# EasyEDA Pro project V2.1.1 AC Power Switch.epro

# Schematic V2.1.1 Schematic
Board Name: V2.1.1 AC Power Switch; Create Date: 2024-09-30; Page Name: Main Page; Project Name: Access Control AC Power Switch; Schematic Name: V2.1.1 Schematic; Update Date: 2025-06-26
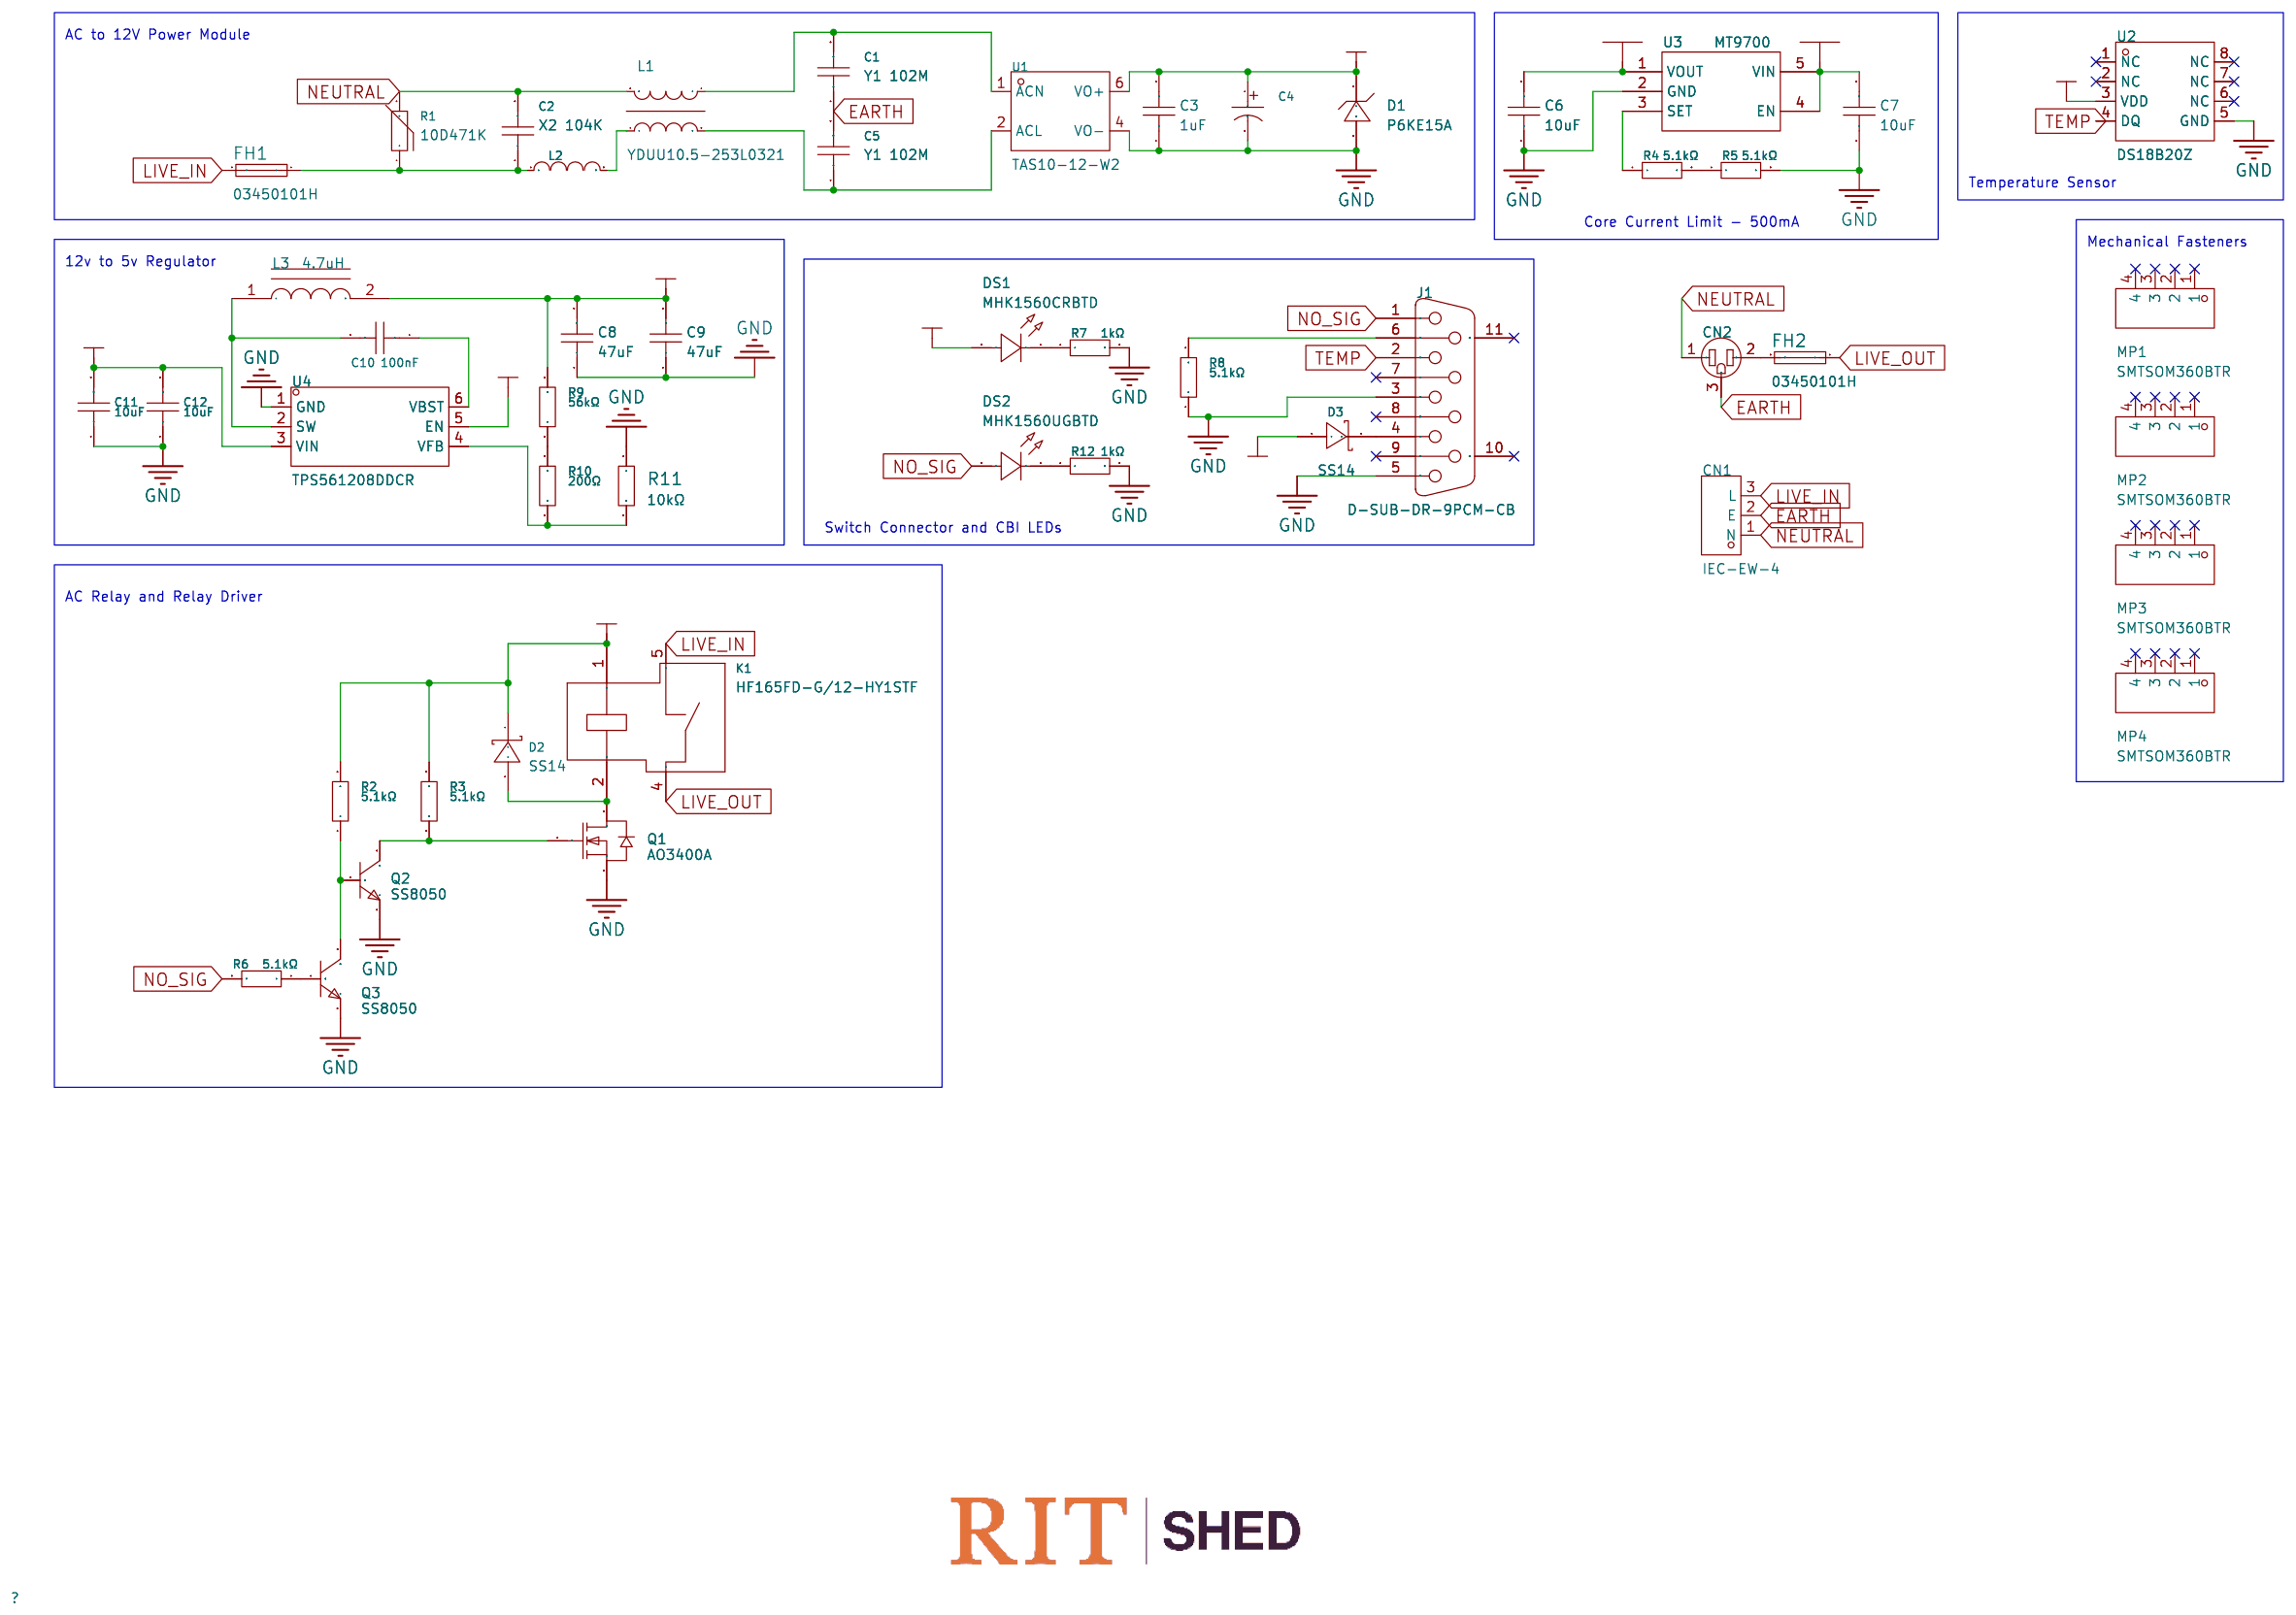
[diagram p0: schematic sheet]

## Parts
C1  1nF  [CAP-TH_L8.5-W5.0-P10.00-D0.6]
C2  100nF  [CAP-TH_L10.0-W5.0-P7.50-D0.6]
C3  1uF  [C1206]
C4  220uF  [CAP-TH_BD6.3-P2.50-D1.0-FD]
C5  1nF  [CAP-TH_L8.5-W5.0-P10.00-D0.6]
C6  10uF  [C0603]
C7  10uF  [C0603]
C8  47uF  [C1206]
C9  47uF  [C1206]
C10  100nF  [C0603]
C11  10uF  [C0603]
C12  10uF  [C0603]
CN1  IEC-EW-4  [CONN-TH_IEC-EW-4]
CN2  -  [739W-X2/32]
D1  P6KE15A  [DO-15_BD3.1-L6.7-P10.70-D0.9-RD]
D2  SS14  [SMA_L4.2-W2.6-LS5.3-RD]
D3  SS14  [SMA_L4.2-W2.6-LS5.3-RD]
DS1  MHK1560CRBTD  [LED-TH_MHK1560UGBTD]
DS2  MHK1560UGBTD  [LED-TH_MHK1560UGBTD]
FH1  03450101H  [03450101H]
FH2  03450101H  [03450101H]
J1  D-SUB-DR-9PCM-CB  [DB9-TH_ID09S33E4GV00LF]
K1  HF165FD-G/12-HY1STF  [RELAY-TH_HF165FD-G-12-HY1STF]
L1  YDUU10.5-253L0321  [IND-TH_4P-L19.0-W17.0]
L2  560uH  [IND-TH_BD9.0-P5.00-D0.7]
L3  4.7uH  [IND-SMD_L4.4-W4.2]
MP1  SMTSOM360BTR  [SMD_BD5.6-D4.1]
MP2  SMTSOM360BTR  [SMD_BD5.6-D4.1]
MP3  SMTSOM360BTR  [SMD_BD5.6-D4.1]
MP4  SMTSOM360BTR  [SMD_BD5.6-D4.1]
Q1  AO3400A  [SOT-23-3_L2.9-W1.3-P1.90-LS2.4-BR]
Q2  SS8050  [SOT-23-3_L2.9-W1.3-P1.90-LS2.4-BR]
Q3  SS8050  [SOT-23-3_L2.9-W1.3-P1.90-LS2.4-BR]
R1  10D471K  [RES-TH_L12.5-W6.7-P7.50-D1.2]
R2  5.1kΩ  [R0603]
R3  5.1kΩ  [R0603]
R4  5.1kΩ  [R0603]
R5  5.1kΩ  [R0603]
R6  5.1kΩ  [R0603]
R7  1kΩ  [R0603]
R8  5.1kΩ  [R0603]
R9  56kΩ  [R0603]
R10  200Ω  [R0603]
R11  10kΩ  [R0603]
R12  1kΩ  [R0603]
U1  TAS10-12-W2  [PWRM-TH_TAS10-XX-W2]
U2  DS18B20Z  [SOP-8_L4.9-W3.9-P1.27-LS6.0-BL]
U3  MT9700  [SOT-23-5_L3.0-W1.7-P0.95-LS2.8-BR]
U4  TPS561208DDCR  [TSOT-23-6_L2.9-W1.6-P0.95-LS2.8-BR]

## Library data of the parts
C1 C5 = VY1102M31Y5UC63V0: Capacitance: Tolerance:±20% Tolerance:±20% Voltage(AC):760V Subclass: Operating Temperature:-40℃~+125℃ Operating Temperature:-40℃~+125℃; LCSC Part Name: 等级:X1,Y1 1nF ±20% 760V; Supplier Part: C1620957; Manufacturer: VISHAY(威世); Supplier Footprint: 插件,P=10mm; JLCPCB Part Class: Extended Part; Datasheet: https://atta.szlcsc.com/upload/public/pdf/source/20210503/4C6D9DFEC0766624DBEA7F26F929BB18.pdf; Supplier: LCSC; Tolerance: ±20%; Voltage(AC): 760V; Operating Temperature: -40℃~+125℃
C2 = PX104K2C0702: Capacitance: Tolerance:±10% Tolerance:±10% Voltage(AC):310V；380V；350V Subclass: Operating Temperature:-40℃~+110℃ Operating Temperature:-40℃~+110℃; LCSC Part Name: 等级:X2 100nF ±10% 310V 350V 380V; Supplier Part: C2693793; Manufacturer: KYET(科雅); Supplier Footprint: 插件,P=7.5mm; JLCPCB Part Class: Extended Part; Datasheet: https://atta.szlcsc.com/upload/public/pdf/source/20230824/212A883DA7F3524E26A294E17BC5A0F4.pdf; Supplier: LCSC; Tolerance: ±10%; Voltage(AC): 310V；380V；350V; Operating Temperature: -40℃~+110℃
C3 = CL31B105KBHNNNE: Capacitance: Tolerance:±10% Tolerance:±10% Voltage Rated: Temperature Coefficient:; LCSC Part Name: 1uF ±10% 50V; Supplier Part: C1848; Manufacturer: SAMSUNG(三星); Supplier Footprint: 1206; JLCPCB Part Class: Basic Part; Datasheet: https://atta.szlcsc.com/upload/public/pdf/source/20160218/1457707763339.pdf; Supplier: LCSC; Tolerance: ±10%
C4 = KM227M025E11RR0VH2FP0: Capacitance:220uF Tolerance:±20% Tolerance:±20% Rated Voltage: Ripple Current:- Equivalent Series Resistance(ESR):- Lead Spacing: φD: L: Lifetime @ Temp:1000hrs@105℃; LCSC Part Name: 220uF ±20% 25V; Supplier Part: C12450; Manufacturer: CX(承兴); Supplier Footprint: 插件,D6.3xL11mm; JLCPCB Part Class: Extended Part; Datasheet: https://atta.szlcsc.com/upload/public/pdf/source/20211027/06D6BA3719C264B639DC286D935D03EA.pdf; Supplier: LCSC; Tolerance: ±20%; Lifetime @ Temp: 1000hrs@105℃
C6 C7 = CL10A106MA8NRNC: Capacitance: Tolerance:±20% Tolerance:±20% Voltage Rated: Temperature Coefficient:; LCSC Part Name: 10uF ±20% 25V; Supplier Part: C96446; Manufacturer: SAMSUNG(三星); Supplier Footprint: 0603; Datasheet: https://atta.szlcsc.com/upload/public/pdf/source/20170325/1490427913016.pdf; Supplier: LCSC; Tolerance: ±20%
C8 C9 = CL31A476MPHNNNE: Capacitance: Tolerance:±20% Tolerance:±20% Voltage Rated: Temperature Coefficient:; LCSC Part Name: 47uF ±20% 10V; Supplier Part: C96123; Manufacturer: SAMSUNG(三星); Supplier Footprint: 1206; JLCPCB Part Class: Basic Part; Datasheet: https://atta.szlcsc.com/upload/public/pdf/source/20160218/1457707763339.pdf; Supplier: LCSC; Tolerance: ±20%
C10 = CC0603KRX7R9BB104: Capacitance: Tolerance:±10% Tolerance:±10% Voltage Rated: Temperature Coefficient:; LCSC Part Name: 100nF ±10% 50V; Supplier Part: C14663; Manufacturer: YAGEO(国巨); Supplier Footprint: 0603; JLCPCB Part Class: Basic Part; Datasheet: https://atta.szlcsc.com/upload/public/pdf/source/20180910/C282072_33301C7F631E79921B82A8DAC6BCC5B3.pdf; Supplier: LCSC; Tolerance: ±10%
C11 C12 = CL10A106MA8NRNC: Capacitance: Tolerance:±20% Tolerance:±20% Voltage Rated: Temperature Coefficient:; LCSC Part Name: 10uF ±20% 25V; Supplier Part: C96446; Manufacturer: SAMSUNG(三星); Supplier Footprint: 0603; JLCPCB Part Class: Basic Part; Datasheet: https://atta.szlcsc.com/upload/public/pdf/source/20160218/1457707763339.pdf; Supplier: LCSC; Tolerance: ±20%
CN1 = IEC-EW-4: Supplier Part: C17684530; Manufacturer: ADAM TECH; JLCPCB Part Class: Extended Part; Supplier: LCSC
CN2 = 739W-X2/32
D1 = P6KE15A_C432720: Reverse Stand-Off Voltage (Vrwm):12.8V Maximum Clamping Voltage:21.2V Peak Pulse Current (Ipp)@10/1000us:29A Breakdown Voltage:14.3V Type:TVS; LCSC Part Name: TVS 12.8V截止 28A峰值脉冲; Supplier Part: C432720; Manufacturer: PINGWEI(平伟); Supplier Footprint: DO-15; JLCPCB Part Class: Extended Part; Datasheet: https://atta.szlcsc.com/upload/public/pdf/source/20191125/C432720_41B798BD7A6A58F5BCFD447C95CDC42D.pdf; Supplier: LCSC; Reverse Stand-Off Voltage (Vrwm): 12.8V; Maximum Clamping Voltage: 21.2V; Peak Pulse Current (Ipp)@10/1000us: 29A; Breakdown Voltage: 14.3V; Type: TVS
D2 D3 = SS14_C2480: Diode Configuration:Single Forward Voltage (Vf@If):550mV@1A Reverse Voltage (Vr):40V Average Rectified Current (Io):1A Reverse Leakage Current (Ir):500uA@40V; LCSC Part Name: 电压:40V 电流:1A; Supplier Part: C2480; Manufacturer: MDD; Supplier Footprint: SMA(DO-214AC); JLCPCB Part Class: Basic Part; Datasheet: https://atta.szlcsc.com/upload/public/pdf/source/20230712/2DB6064CFBB99DE6DB116BEE8208BE66.pdf; Supplier: LCSC; Diode Configuration: Single; Forward Voltage (Vf@If): 550mV@1A; Reverse Voltage (Vr): 40V; Average Rectified Current (Io): 1A; Reverse Leakage Current (Ir): 500uA@40V
DS1 = MHK1560CGBTD: 20mA 雾状红透镜 50mcd -40℃~+85℃ 632nm Red 85° 1.75V~2.2V Plugin,P=2.54mm Light Emitting Diodes (LED) ROHS; LCSC Part Name: 1560直插单灯翠绿色光; Supplier Part: C7470835; Manufacturer: MEIHUA(美华); Supplier Footprint: 插件,P=2.54mm; JLCPCB Part Class: Extended Part; Datasheet: https://atta.szlcsc.com/upload/public/pdf/source/20231114/0151DB1F997DCF286213A722D08B4BAA.pdf; Supplier: LCSC; Emitted Color: Emerald; Forward Voltage (VF): 1.75V~2.2V; Forward Current: 20mA; Dominant Wavelength: 520nm; Lens Color: 雾状绿透镜; Luminous Intensity: 1000mcd; Viewing Angle: 85°; Operating Temperature: -40℃~+85℃
DS2 = MHK1560UGBTD: Emitted Color:Emerald Forward Voltage (VF):1.75V~2.2V Forward Voltage (VF):1.75V~2.2V Forward Current:20mA Dominant Wavelength:520nm Dominant Wavelength:520nm Lens Color:雾状绿透镜 Luminous Intensity:1000mcd Luminous Intensity:1000mcd Viewing Angle:85° Operati; LCSC Part Name: 1560直插单灯翠绿色光; Supplier Part: C7470833; Manufacturer: MEIHUA(美华); Supplier Footprint: 插件,P=2.54mm; JLCPCB Part Class: Extended Part; Datasheet: https://atta.szlcsc.com/upload/public/pdf/source/20231114/0151DB1F997DCF286213A722D08B4BAA.pdf; Supplier: LCSC; Emitted Color: Emerald; Forward Voltage (VF): 1.75V~2.2V; Forward Current: 20mA; Dominant Wavelength: 520nm; Lens Color: 雾状绿透镜; Luminous Intensity: 1000mcd; Viewing Angle: 85°; Operating Temperature: -40℃~+85℃
FH1 FH2 = 03450101H: Fuseholder Type:- Fuse Type:- Fuse Size:-; Supplier Part: C206934; Manufacturer: Littelfuse(美国力特); JLCPCB Part Class: Extended Part; Datasheet: https://atta.szlcsc.com/upload/public/pdf/source/20180717/C206934_D0DC376832E6152EDA155E6DDF74EAF3.pdf; Supplier: LCSC
J1 = D-SUB-DR-9PCM-CB: Connector Type:D-Sub Gender:Female Number of Pins:9P Mounting Style:Right-Angle Number of Rows:2 Current Rating (Max):3A Contact Plating:Tin Operating Temperature Range:-50℃~+105℃ Operating Temperature Range:-50℃~+105℃; LCSC Part Name: D-Sub 母 P数:9P; Supplier Part: C19077337; Manufacturer: XUNPU(讯普); Supplier Footprint: 弯插; JLCPCB Part Class: Extended Part; Datasheet: https://atta.szlcsc.com/upload/public/pdf/source/20231108/FB2E8AB0BE4F620DDF3F7F4D0B9AFB97.pdf; Supplier: LCSC; Connector Type: D-Sub; Gender: Female; Number of Pins: 9P; Mounting Style: Right-Angle; Number of Rows: 2; Current Rating (Max): 3A; Contact Plating: Tin; Operating Temperature Range: -50℃~+105℃
K1 = HF165FD-G/12-HY1STF: Coil Voltage:12V Contact Form:一组常开:1A(SPST-常开) Pin Number:4 Contact Rating:40A@277VAC Maximum Switching Voltage:277V@AC Coil Rated Power:900mW Contact Material:AgSnO2 Maximum Switching Current:40A Coil Type:无极性-单线圈 Coil Resistance:155Ω Contact Resistance:; Supplier Part: C129738; Manufacturer: HF(宏发); Supplier Footprint: 插件,27.5x32.2mm; JLCPCB Part Class: Extended Part; Datasheet: https://atta.szlcsc.com/upload/public/pdf/source/20171116/C139499_15108221312811123741.pdf; Supplier: LCSC; Coil Voltage: 12V; Contact Form: 一组常开:1A(SPST-常开); Pin Number: 4; Contact Rating: 40A@277VAC; Maximum Switching Voltage: 277V@AC; Coil Rated Power: 900mW; Contact Material: AgSnO2; Maximum Switching Current: 40A; Coil Type: 无极性-单线圈; Coil Resistance: 155Ω; Contact Resistance: 100mΩ; Operate Time: 15ms; Release Time: 10ms; Operating Temperature: -40℃~+85℃
L1 = YDUU10.5-253L0321: Number of Lines:2 Withstanding Voltage:1.5kV@AC Inductance @ Frequency:25mH@1KHz; LCSC Part Name: UU10.5 25mH @1KHz; Supplier Part: C5200263; Manufacturer: YJYCOIN(益嘉源); Supplier Footprint: 插件,19x17x22mm; JLCPCB Part Class: Extended Part; Datasheet: https://atta.szlcsc.com/upload/public/pdf/source/20221019/CF3EF2D4E89C9F1A1EF6A77931981DBC.pdf; Supplier: LCSC; Number of Lines: 2; Withstanding Voltage: 1.5kV@AC; Inductance @ Frequency: 25mH@1KHz
L2 = PK0810-561KB: Inductance: Tolerance:±10% Tolerance:±10% Rated Current: DC Resistance (DCR): Type:工字电感; LCSC Part Name: 560uH ±10%; Supplier Part: C122800; Manufacturer: SXN(顺翔诺); Supplier Footprint: 插件; JLCPCB Part Class: Extended Part; Datasheet: https://atta.szlcsc.com/upload/public/pdf/source/20210810/BA6D1DA7D4BCBB7C641BC97B42CFC6FF.pdf; Supplier: LCSC; Tolerance: ±10%; Type: 工字电感
L3 = BCIHP0420SC-4R7M: Inductance: Tolerance:±20% Tolerance:±20% Rated Current: Saturation Current (Isat): DC Resistance (DCR):126mΩ Q @ Freq:- Frequency - Self Resonant:-; LCSC Part Name: 4.7uH ±20% 3A; Supplier Part: C2921168; Manufacturer: BC(台湾诚阳); Supplier Footprint: SMD,4.2x4.4mm; JLCPCB Part Class: Extended Part; Datasheet: https://atta.szlcsc.com/upload/public/pdf/source/20220607/0F62A2B68923DD0945D5F83B99590D06.pdf; Supplier: LCSC; Tolerance: ±20%; DC Resistance (DCR): 126mΩ
MP1-MP4 = SMTSOM360BTR: LCSC Part Name: YIYUAN(怡远)M3贴片螺母 铜镀锡 PCB贴片连接器SMTSOM360BTR; Supplier Part: C5221846; Manufacturer: YIYUAN(怡远); JLCPCB Part Class: Extended Part; Datasheet: https://atta.szlcsc.com/upload/public/pdf/source/20230202/A42D22DA7D93D728E13784C4003E4077.pdf; Supplier: LCSC
Q1 = AO3400A_C20917: Type:1 N-Channel Drain Source Voltage (Vdss): Continuous Drain Current (Id): Power Dissipation (Pd): Drain Source On Resistance (RDS(on)@Vgs,Id):26.5mΩ@10V,5.7A Gate Threshold Voltage (Vgs(th)@Id):1.5V@250uA Total Gate Charge (Qg@Vgs):7nC@4.5V Input Capac; LCSC Part Name: 1个N沟道 耐压:30V 电流:5.7A; Supplier Part: C20917; Manufacturer: AOS; Supplier Footprint: SOT-23-3L; JLCPCB Part Class: Basic Part; Datasheet: https://atta.szlcsc.com/upload/public/pdf/source/20140107/1457706668533.pdf; Supplier: LCSC; Type: 1 N-Channel; Drain Source On Resistance (RDS(on)@Vgs,Id): 26.5mΩ@10V,5.7A; Gate Threshold Voltage (Vgs(th)@Id): 1.5V@250uA; Total Gate Charge (Qg@Vgs): 7nC@4.5V; Input Capacitance (Ciss@Vds): 630pF@15V; Operating Temperature: -55℃~+150℃@(Tj)
Q2 Q3 = SS8050_C2150: Transistor Type: Collector Current (Ic): Collector-Emitter Breakdown Voltage (Vceo): Power Dissipation (Pd): DC Current Gain (hFE@Ic,Vce):200@100mA,1V DC Current Gain (hFE@Ic,Vce):200@100mA,1V Transition Frequency (fT):100MHz Collector Cut-Off Current (Ic; LCSC Part Name: SS8050(RANGE:200-350) hfe=200~350; Supplier Part: C2150; Manufacturer: CJ(江苏长电/长晶); Supplier Footprint: SOT-23; JLCPCB Part Class: Basic Part; Datasheet: https://atta.szlcsc.com/upload/public/pdf/source/20230322/AEE86F4B043774EFF80CAEA14A37D9E9.pdf; Supplier: LCSC; DC Current Gain (hFE@Ic,Vce): 200@100mA,1V; Transition Frequency (fT): 100MHz; Collector Cut-Off Current (Icbo): 100nA; Collector-Emitter Saturation Voltage (VCE(sat)@Ic,Ib): 500mV@800mA,80mA
R1 = 10D471K_C8760: Varistor Voltage:423V~517V Varistor Voltage:423V~517V Clamping Voltage: Allowable Voltage (DC): Allowable Voltage (AC): Peak Current: Maximum Energy:42.3J Maximum Energy:42.3J Typical Capatitance:190pF@1kHz; LCSC Part Name: 钳位电压775V 42.3焦耳 插件压敏电阻; Supplier Part: C8760; Manufacturer: RUILON(瑞隆源); Supplier Footprint: 插件; JLCPCB Part Class: Extended Part; Datasheet: https://atta.szlcsc.com/upload/public/pdf/source/20160725/1469440740918.pdf; Supplier: LCSC; Varistor Voltage: 423V~517V; Maximum Energy: 42.3J; Typical Capatitance: 190pF@1kHz
R2-R6 R8 = 0603WAF5101T5E: Type:Thick Film Resistors Resistance:5.1kΩ Tolerance:±1% Tolerance:±1% Power(Watts): Overload Voltage (Max): Temperature Coefficient:±100ppm/℃ Temperature Coefficient:±100ppm/℃ Operating Temperature Range:-55℃~+155℃ Operating Temperature Range:-55℃~+155℃; LCSC Part Name: 5.1kΩ ±1% 100mW 厚膜电阻; Supplier Part: C23186; Manufacturer: UNI-ROYAL(厚声); Supplier Footprint: 0603; JLCPCB Part Class: Basic Part; Datasheet: https://atta.szlcsc.com/upload/public/pdf/source/20200306/C422600_1E6D84923E4A46A82E41ADD87F860B5C.pdf; Supplier: LCSC; Type: Thick Film Resistors; Tolerance: ±1%; Temperature Coefficient: ±100ppm/℃; Operating Temperature Range: -55℃~+155℃
R7 R12 = 0603WAF1001T5E: Type:Thick Film Resistors Resistance:1kΩ Tolerance:±1% Tolerance:±1% Power(Watts): Overload Voltage (Max): Temperature Coefficient:±100ppm/℃ Temperature Coefficient:±100ppm/℃ Operating Temperature Range:-55℃~+155℃ Operating Temperature Range:-55℃~+155℃; LCSC Part Name: 1kΩ ±1% 100mW 厚膜电阻; Supplier Part: C21190; Manufacturer: UNI-ROYAL(厚声); Supplier Footprint: 0603; JLCPCB Part Class: Basic Part; Datasheet: https://atta.szlcsc.com/upload/public/pdf/source/20200306/C422600_1E6D84923E4A46A82E41ADD87F860B5C.pdf; Supplier: LCSC; Type: Thick Film Resistors; Tolerance: ±1%; Temperature Coefficient: ±100ppm/℃; Operating Temperature Range: -55℃~+155℃
R9 = 0603WAF5602T5E: Type:Thick Film Resistors Resistance:56kΩ Tolerance:±1% Tolerance:±1% Power(Watts): Overload Voltage (Max): Temperature Coefficient:±100ppm/℃ Temperature Coefficient:±100ppm/℃ Operating Temperature Range:-55℃~+155℃ Operating Temperature Range:-55℃~+155℃; LCSC Part Name: 56kΩ ±1% 100mW 厚膜电阻; Supplier Part: C23206; Manufacturer: UNI-ROYAL(厚声); Supplier Footprint: 0603; JLCPCB Part Class: Basic Part; Datasheet: https://atta.szlcsc.com/upload/public/pdf/source/20200306/C422600_1E6D84923E4A46A82E41ADD87F860B5C.pdf; Supplier: LCSC; Type: Thick Film Resistors; Tolerance: ±1%; Temperature Coefficient: ±100ppm/℃; Operating Temperature Range: -55℃~+155℃
R10 = 0603WAF2000T5E: Type:Thick Film Resistors Resistance: Tolerance:±1% Tolerance:±1% Power(Watts): Overload Voltage (Max): Temperature Coefficient:±100ppm/℃ Temperature Coefficient:±100ppm/℃ Operating Temperature Range:-55℃~+155℃ Operating Temperature Range:-55℃~+155℃; LCSC Part Name: 200Ω ±1% 100mW 厚膜电阻; Supplier Part: C8218; Manufacturer: UNI-ROYAL(厚声); Supplier Footprint: 0603; JLCPCB Part Class: Basic Part; Datasheet: https://atta.szlcsc.com/upload/public/pdf/source/20200306/C422600_1E6D84923E4A46A82E41ADD87F860B5C.pdf; Supplier: LCSC; Type: Thick Film Resistors; Tolerance: ±1%; Temperature Coefficient: ±100ppm/℃; Operating Temperature Range: -55℃~+155℃
R11 = 0603WAF1002T5E: Type:Thick Film Resistors Resistance:10kΩ Tolerance:±1% Tolerance:±1% Power(Watts): Overload Voltage (Max): Temperature Coefficient:±100ppm/℃ Temperature Coefficient:±100ppm/℃ Operating Temperature Range:-55℃~+155℃ Operating Temperature Range:-55℃~+155℃; Supplier: LCSC; Manufacturer: UNI-ROYAL(厚声); Supplier Part: C25804; JLCPCB Part Class: Basic Part; LCSC Part Name: 厚膜电阻 10kΩ ±1% 100mW; Supplier Footprint: 0603; Datasheet: https://atta.szlcsc.com/upload/public/pdf/source/20200306/C422600_1E6D84923E4A46A82E41ADD87F860B5C.pdf; Type: Thick Film Resistors; Tolerance: ±1%; Temperature Coefficient: ±100ppm/℃; Operating Temperature Range: -55℃~+155℃
U1 = TAS10-12-W2: Conversion Type:AC-DC；AC/DC-DC Input Voltage(DC):100V~370V Input Voltage(DC):100V~370V Output Voltage:12V Output Voltage:12V Output Power:10W Input Voltage(AC):85VAC~265VAC Input Voltage(AC):85VAC~265VAC Output Current (Max):830mA Output Current (Max):830; Supplier Part: C2687656; Manufacturer: TDPOWER(腾达电源); Supplier Footprint: 插件,25x39mm; JLCPCB Part Class: Extended Part; Datasheet: https://atta.szlcsc.com/upload/public/pdf/source/20210914/95F169B7B21081D929A6CFE8A15609A6.pdf; Supplier: LCSC; Conversion Type: AC-DC；AC/DC-DC; Input Voltage(DC): 100V~370V; Output Voltage: 12V; Output Power: 10W; Input Voltage(AC): 85VAC~265VAC; Output Current (Max): 830mA; Function: 降压型; Isolation or not: 隔离; Output Channel: 1; Insulated Voltage: 2.5kV@AC; Conversion Efficiency: 85%; Feature: Overcurrent Protection；短路保护自恢复
U2 = DS18B20Z: Resolution:±0.4℃ Resolution:±0.4℃ Supply Voltage:2.5V~5.5V Supply Voltage:2.5V~5.5V; LCSC Part Name: 温度传感器; Supplier Part: C695837; Manufacturer: UMW(友台半导体); Supplier Footprint: SOIC-8; JLCPCB Part Class: Extended Part; Datasheet: https://atta.szlcsc.com/upload/public/pdf/source/20231109/DC3DA9D47D486EF40A6E0F08B9A498E3.pdf; Supplier: LCSC; Resolution: ±0.4℃; Supply Voltage: 2.5V~5.5V
U3 = MT9700: Supplier Part: C89855; Manufacturer: 西安航天民芯; Supplier Footprint: SOT-23-5; Datasheet: https://atta.szlcsc.com/upload/public/pdf/source/20170418/1492481333031.pdf; Supplier: LCSC
U4 = TPS561208DDCR: Function:Step-down type Output Type:Adjustable Input Voltage:4.5V~17V Input Voltage:4.5V~17V Output Voltage:760mV~7V Output Voltage:760mV~7V Output Current (Max):1A Switching Frequency:580kHz Operating Temperature:-40℃~+85℃@(TA) Operating Temperature:-40℃; Supplier Part: C138335; Manufacturer: TI(德州仪器); Supplier Footprint: TSOT-23-6; JLCPCB Part Class: Extended Part; Datasheet: https://www.ti.com/cn/lit/gpn/tps561208; Supplier: LCSC; Function: Step-down type; Output Type: Adjustable; Input Voltage: 4.5V~17V; Output Voltage: 760mV~7V; Output Current (Max): 1A; Switching Frequency: 580kHz; Operating Temperature: -40℃~+85℃@(TA); Synchronous Rectification: Yes; Number of Outputs: 1; Topology: Step-down; Switch tube (built-in/external): 内置

## Nets
GND: C3.1 C4.2 C6.1 C7.1 C8.1 C9.1 C11.1 C12.1 D1.2 J1.3 J1.5 Q1.2(S) Q2.2(E) Q3.2(E) R5.2 R7.2 R8.1 R11.1 R12.2 U1.4(VO-) U2.5(GND) U3.2(GND) U4.1(GND)
VIN: C7.2 C8.2 C9.2 L3.2 R9.2 U2.3(VDD) U3.4(EN) U3.5(VIN)
EARTH: C1.1 C5.2 CN1.2(E) CN2.3
LIVE_IN: CN1.3(L) FH1.2 K1.5
LIVE_OUT: FH2.1 K1.4
NEUTRAL: C2.2 CN1.1(N) CN2.1 L1.3 R1.2
NO_SIG: DS2.2(A) J1.1 R6.2
TEMP: J1.2 U2.4(DQ)
VRAW: C3.2 C4.1 C11.2 C12.2 D1.1 D2.1(K) K1.1 R2.2 R3.2 U1.6(VO+) U4.3(VIN) U4.5(EN)
VSW: C6.2 D3.2(A) DS1.2(A) U3.1(VOUT)
$1N1636: D2.2(A) K1.2 Q1.3(D)
$1N1642: Q2.1(B) Q3.3(C) R2.1
$1N1954: L1.4 L2.2
$1N1959: C5.1 L1.2 U1.2(ACL)
$1N1966: C1.2 L1.1 U1.1(ACN)
$1N3143: J1.6 R8.2
$1N3234: Q1.1(G) Q2.3(C) R3.1
$1N7143: R4.1 U3.3(SET)
$1N7225: R4.2 R5.1
$1N7266: DS2.1(K) R12.1
$1N7306: DS1.1(K) R7.1
$1N7956: C10.2 L3.1 U4.2(SW)
$1N8144: C10.1 U4.6(VBST)
$1N8366: R9.1 R10.2
$1N8390: R10.1 R11.2 U4.4(VFB)
$1N8924: D3.1(K) J1.4
$1N10465: Q3.1(B) R6.1
$1N17471: C2.1 FH1.1 L2.1 R1.1
$1N23165: CN2.2 FH2.2

Not connected (* = marked no-connect by the designer): J1 7* 8* 9* 10(MH1)* 11(MH2)*; MP1 1* 2* 3* 4*; MP2 1* 2* 3* 4*; MP3 1* 2* 3* 4*; MP4 1* 2* 3* 4*; U2 1(NC)* 2(NC)* 6(NC)* 7(NC)* 8(NC)*

## Notes on the sheet
- AC to 12V Power Module
- Temperature Sensor
- Core Current Limit - 500mA
- Mechanical Fasteners
- 12v to 5v Regulator
- Switch Connector and CBI LEDs
- AC Relay and Relay Driver

# Board V2.1.1 PCB
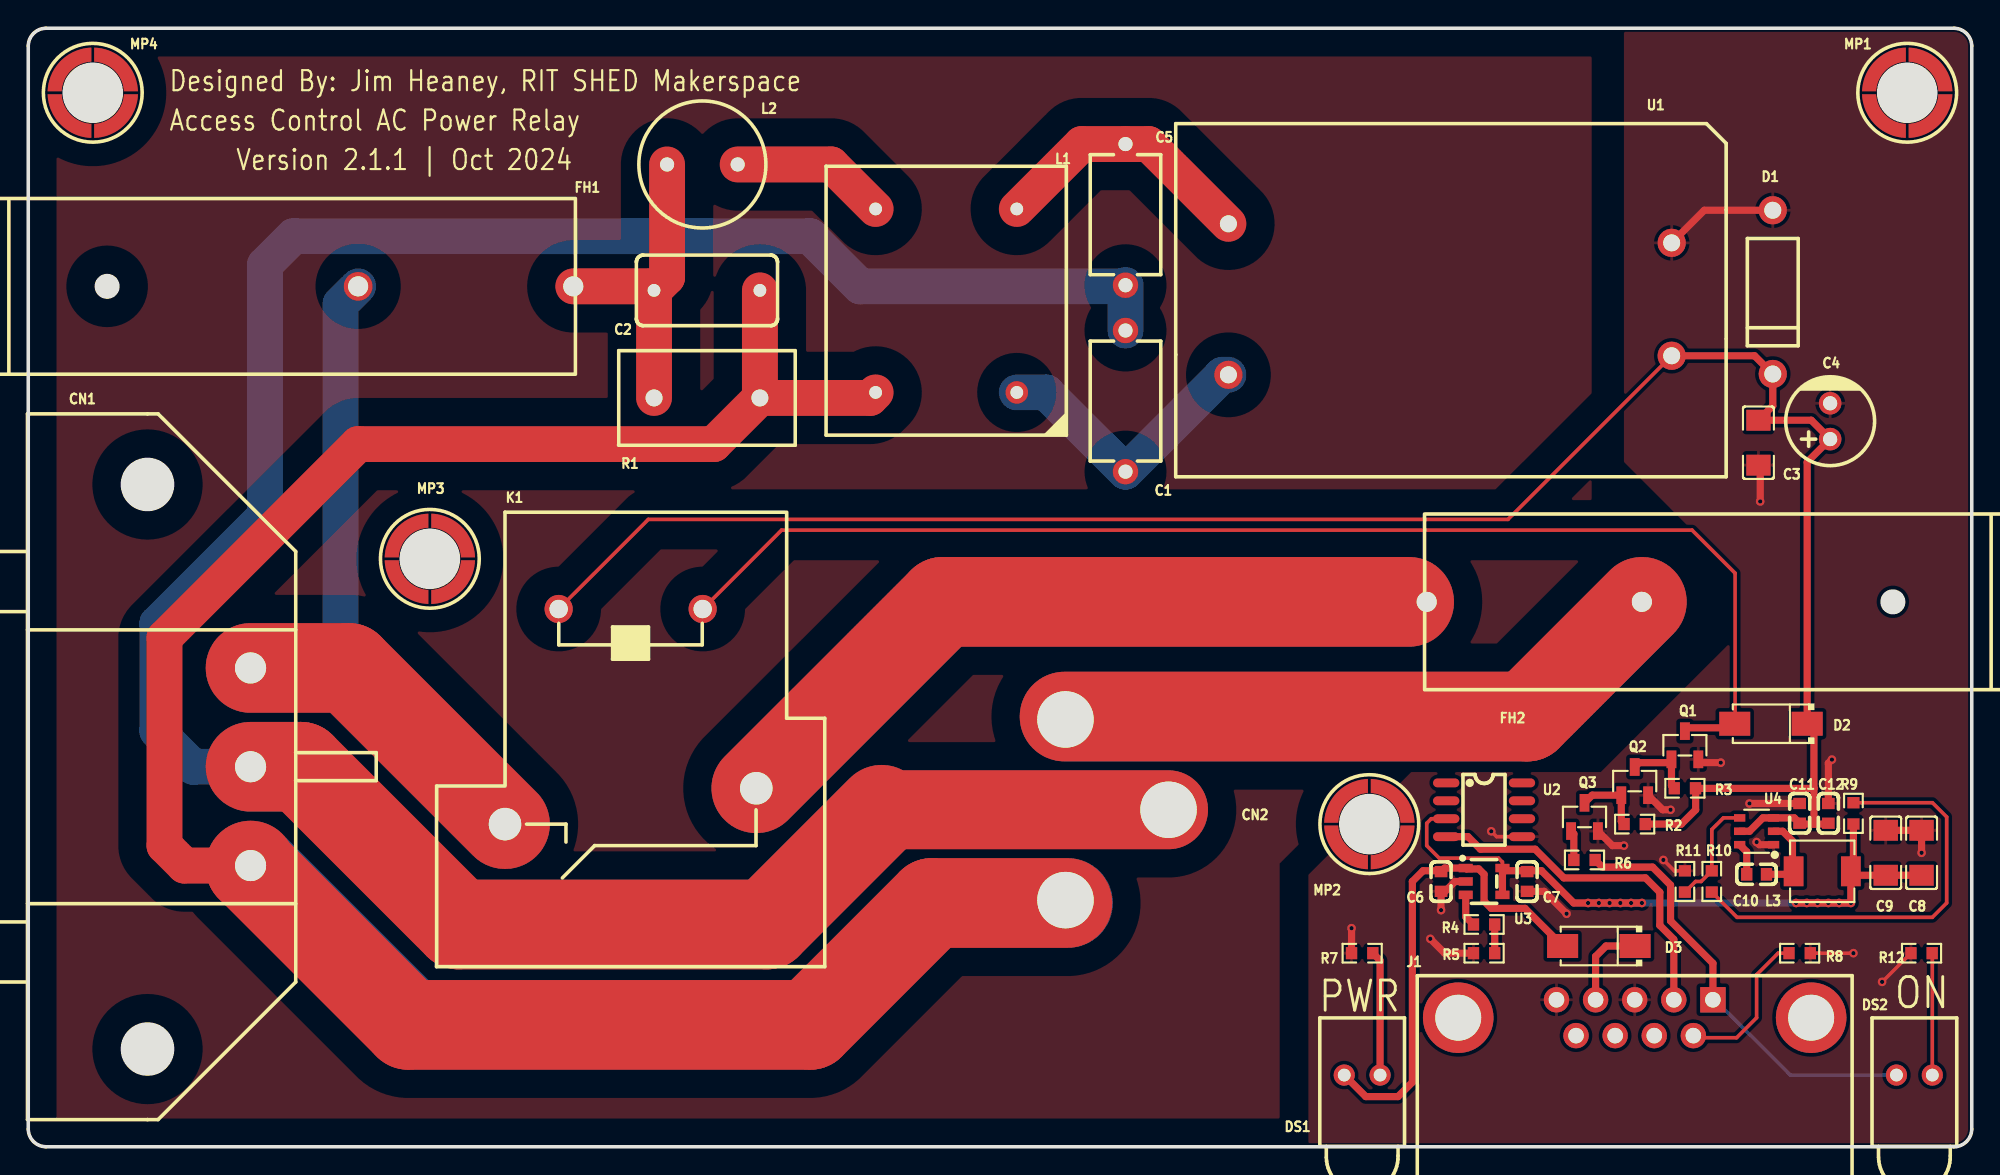
[diagram p1: board, top side]
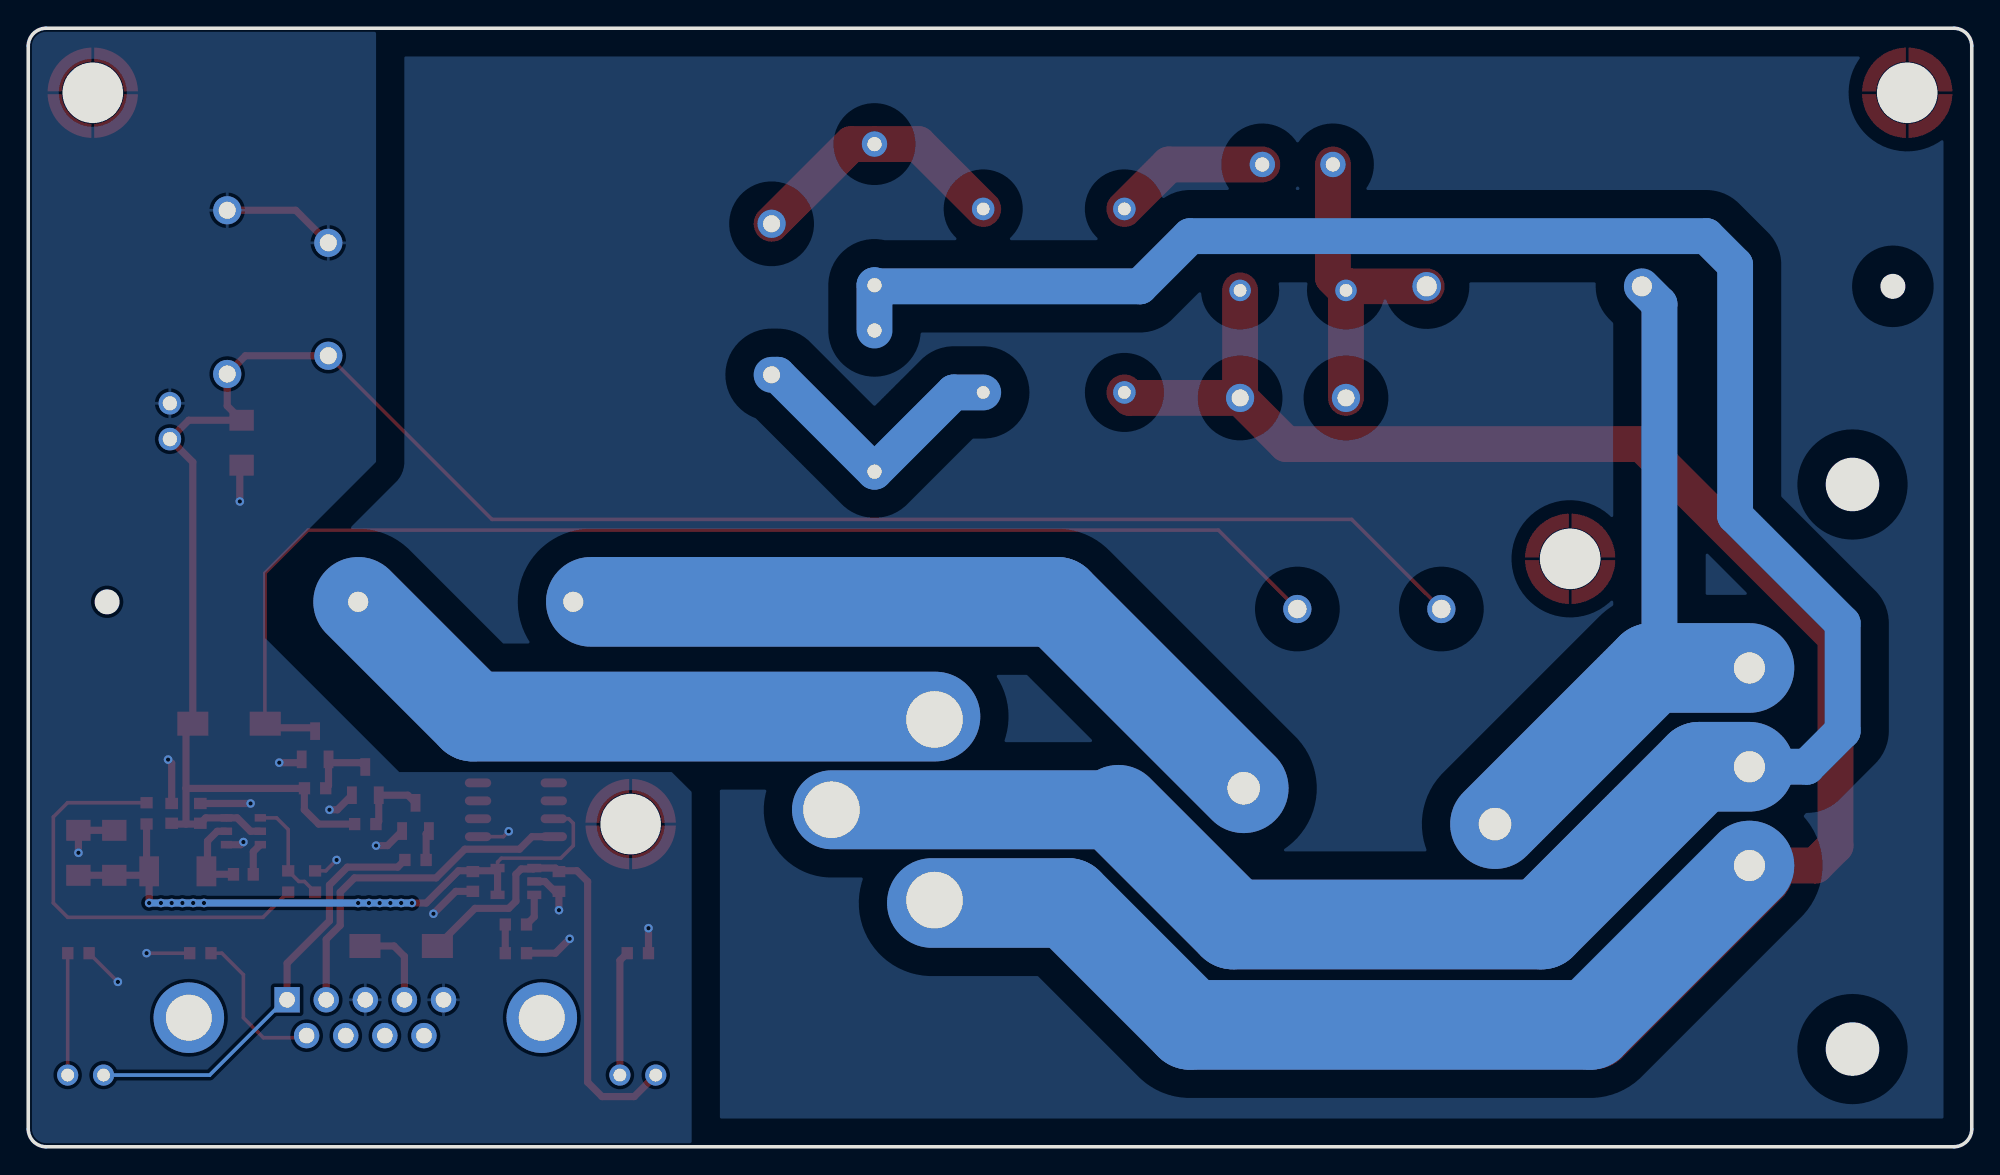
[diagram p2: board, bottom side, seen from below]

Outline 137.67 x 79.25 mm; copper layers: Top Layer, Bottom Layer. Coordinates in mm from the lower left corner of the outline.
Outline path: 0,77.98 0,1.27 arc(0.37,0.37) 1.27,0 136.4,0 arc(137.3,0.37) 137.67,1.27 137.67,77.98 arc(137.3,78.88) 136.4,79.25 1.27,79.25 arc(0.37,78.88) 0,77.98
Stack: Top Layer 0.035mm / Dielectric1 1.51mm FR4 er 4.5 / Bottom Layer 0.035mm

## Design rules (mm)
template: Custom Config
spacing copperThickness1oz (default): track to track 0.254, other pairs 0.254 to 0.381
spacing copperThickness2oz: track to track 0.203, other pairs 0.152 to 0.3
track width copperThickness1oz (default): min 0.127, default 0.254, max 8.89
track width copperThickness2oz: min 0.203, default 0.254, max 2.54
differential pair differentialPair (default): width min 0.127, default 0.254, max 2.54; gap min 0.152, default 0.152
via viaSize (default): diameter min 0.5, default 0.61, max 10; hole min 0.3, default 0.305, max 6.299
net STEAL uses stealcopper
pour e689 uses stealcopper

## Placement (name value [footprint] x y rotation side)
C1  1nF  [CAP-TH_L8.5-W5.0-P10.00-D0.6]  77.72 52.83 270 top
C2  100nF  [CAP-TH_L10.0-W5.0-P7.50-D0.6]  48.08 60.67 0 top
C3  1uF  [C1206]  122.56 49.88 90 top
C4  220uF  [CAP-TH_BD6.3-P2.50-D1.0-FD]  127.64 51.41 90 top
C5  1nF  [CAP-TH_L8.5-W5.0-P10.00-D0.6]  77.72 66.04 270 top
C6  10uF  [C0603]  100.08 18.8 90 top
C7  10uF  [C0603]  106.17 18.8 90 top
C8  47uF  [C1206]  134.11 20.83 270 top
C9  47uF  [C1206]  131.57 20.83 270 top
C10  100nF  [C0603]  122.43 19.3 0 top
C11  10uF  [C0603]  125.48 23.62 270 top
C12  10uF  [C0603]  127.51 23.62 270 top
CN1  IEC-EW-4  [CONN-TH_IEC-EW-4]  15.75 26.92 90 top
CN2  -  [739W-X2/32]  80.77 23.88 270 top
D1  P6KE15A  [DO-15_BD3.1-L6.7-P10.70-D0.9-RD]  123.57 60.55 90 top
D2  SS14  [SMA_L4.2-W2.6-LS5.3-RD]  123.44 29.97 180 top
D3  SS14  [SMA_L4.2-W2.6-LS5.3-RD]  111.25 14.22 180 top
DS1  MHK1560CRBTD  [LED-TH_MHK1560UGBTD]  94.49 5.08 0 top
DS2  MHK1560UGBTD  [LED-TH_MHK1560UGBTD]  133.6 5.08 0 top
FH1  -  [03450101H]  30.99 60.96 0 top
FH2  -  [03450101H]  106.68 38.61 180 top
J1  D-SUB-DR-9PCM-CB  [DB9-TH_ID09S33E4GV00LF]  113.79 9.14 0 top
K1  HF165FD-G/12-HY1STF  [RELAY-TH_HF165FD-G-12-HY1STF]  42.67 30.48 180 top
L1  YDUU10.5-253L0321  [IND-TH_4P-L19.0-W17.0]  65.02 59.94 90 top
L2  560uH  [IND-TH_BD9.0-P5.00-D0.7]  47.75 69.6 0 top
L3  4.7uH  [IND-SMD_L4.4-W4.2]  127.08 19.52 180 top
MP1  SMTSOM360BTR  [SMD_BD5.6-D4.1]  133.1 74.68 0 top
MP2  SMTSOM360BTR  [SMD_BD5.6-D4.1]  95 22.86 0 top
MP3  SMTSOM360BTR  [SMD_BD5.6-D4.1]  28.45 41.66 0 top
MP4  SMTSOM360BTR  [SMD_BD5.6-D4.1]  4.57 74.68 0 top
Q1  AO3400A  [SOT-23-3_L2.9-W1.3-P1.90-LS2.4-BR]  117.35 28.45 270 top
Q2  SS8050  [SOT-23-3_L2.9-W1.3-P1.90-LS2.4-BR]  113.79 25.91 270 top
Q3  SS8050  [SOT-23-3_L2.9-W1.3-P1.90-LS2.4-BR]  110.24 23.37 270 top
R1  10D471K  [RES-TH_L12.5-W6.7-P7.50-D1.2]  48.08 53.05 0 top
R2  5.1kΩ  [R0603]  113.79 22.86 0 top
R3  5.1kΩ  [R0603]  117.35 25.4 0 top
R4  5.1kΩ  [R0603]  103.12 15.75 0 top
R5  5.1kΩ  [R0603]  103.12 13.72 180 top
R6  5.1kΩ  [R0603]  110.24 20.32 0 top
R7  1kΩ  [R0603]  94.49 13.72 180 top
R8  5.1kΩ  [R0603]  125.48 13.72 180 top
R9  56kΩ  [R0603]  129.29 23.62 270 top
R10  200Ω  [R0603]  119.25 18.8 270 top
R11  10kΩ  [R0603]  117.35 18.8 270 top
R12  1kΩ  [R0603]  134.11 13.72 180 top
U1  TAS10-12-W2  [PWRM-TH_TAS10-XX-W2]  100.71 60.04 0 top
U2  DS18B20Z  [SOP-8_L4.9-W3.9-P1.27-LS6.0-BL]  103.12 23.88 270 top
U3  MT9700  [SOT-23-5_L3.0-W1.7-P0.95-LS2.8-BR]  103.12 18.8 180 top
U4  TPS561208DDCR  [TSOT-23-6_L2.9-W1.6-P0.95-LS2.8-BR]  122.43 22.35 0 top

## Footprints (pads in the part's own frame, mm; a bottom-side part is the same pattern mirrored in y, then rotated)
739W-X2/32
  round 5.5 hole 4x3.5: 1(6.4,-7.3) 2(-6.4,-7.3) 3(0,0)
03450101H
  round 2.032 hole 1.423: 1(7.62,0) 2(-7.62,0)
C0603
  rect 0.8x0.9 smd: 1(-0.7,0) 2(0.7,0)
C1206
  rect 1.485x1.728 smd: 1(-1.593,0) 2(1.593,0)
CAP-TH_BD6.3-P2.50-D1.0-FD
  round 1.6 hole 1: 1(-1.27,0) 2(1.27,0)
CAP-TH_L8.5-W5.0-P10.00-D0.6
  round 1.8 hole 1: 1(-5,0) 2(5,0)
CAP-TH_L10.0-W5.0-P7.50-D0.6
  round 1.524 hole 0.9: 1(-3.75,0) 2(3.75,0)
CONN-TH_IEC-EW-4
  round 3.2 hole 2.2: 1(-7,0) 2(0,0) 3(7,0)
DB9-TH_ID09S33E4GV00LF
  rect 1.8x1.8 hole 1.1: 1(5.54,1.27)
  round 1.8 hole 1.1: 2(2.77,1.27) 3(0,1.27) 4(-2.77,1.27) 5(-5.54,1.27) 6(4.155,-1.27) 7(1.385,-1.27) 8(-1.385,-1.27) 9(-4.155,-1.27)
  round 5 hole 3.25: 10(-12.5,0) 11(12.5,0)
DO-15_BD3.1-L6.7-P10.70-D0.9-RD
  round 2 hole 1.2: 1(-5.8,0) 2(5.8,0)
IND-SMD_L4.4-W4.2
  rect 1.4x2.12 smd: 1(2.028,0) 2(-2.028,0)
IND-TH_4P-L19.0-W17.0
  round 1.6 hole 0.9: 1(-6.5,-5) 2(6.5,-5) 3(-6.5,5) 4(6.5,5)
IND-TH_BD9.0-P5.00-D0.7
  round 1.8 hole 1: 1(-2.5,0) 2(2.5,0)
LED-TH_MHK1560UGBTD
  round 1.5 hole 0.9: 1(1.27,0) 2(-1.27,0)
PWRM-TH_TAS10-XX-W2
  round 2 hole 1.2: 1(-15.7,-5.35) 2(-15.7,5.35) 4(15.7,4) 6(15.7,-4)
R0603
  rect 0.806x0.864 smd: 1(-0.753,0) 2(0.753,0)
RELAY-TH_HF165FD-G-12-HY1STF
  round 2 hole 1.3: 1(5.101,-7.62) 2(-5.101,-7.62)
  round 3.2 hole 2.3: 4(-8.9,5.08) 5(8.9,7.62)
RES-TH_L12.5-W6.7-P7.50-D1.2
  round 2 hole 1.2: 1(-3.749,0) 2(3.749,0)
SMA_L4.2-W2.6-LS5.3-RD
  rect 2.2x1.7 smd: 1(-2.566,0) 2(2.566,0)
SMD_BD5.6-D4.1
  custom 3.1x3.1 smd: 1(-2.102,1.65) 2(1.65,2.102) 3(2.102,-1.65) 4(-1.65,-2.102)
SOP-8_L4.9-W3.9-P1.27-LS6.0-BL
  oval 0.63x1.865 smd: 1(-1.905,-2.683) 2(-0.635,-2.683) 3(0.635,-2.683) 4(1.905,-2.683) 5(1.905,2.683) 6(0.635,2.683) 7(-0.635,2.683) 8(-1.905,2.683)
SOT-23-3_L2.9-W1.3-P1.90-LS2.4-BR
  rect 1.25x0.7 smd: 1(1,-0.95) 2(1,0.95) 3(-1,0)
SOT-23-5_L3.0-W1.7-P0.95-LS2.8-BR
  rect 1x0.6 smd: 1(1.3,-0.95) 2(1.3,0) 3(1.3,0.95) 4(-1.3,0.95) 5(-1.3,-0.95)
TSOT-23-6_L2.9-W1.6-P0.95-LS2.8-BR
  rect 0.8x0.532 smd: 1(1.2,-0.95) 2(1.2,0) 3(1.2,0.95) 4(-1.2,0.95) 5(-1.2,0) 6(-1.2,-0.95)

## Nets
As in the schematic.

Pads without a net: J1 7 8 9 10 11; MP1 1 2 3 4; MP2 1 2 3 4; MP3 1 2 3 4; MP4 1 2 3 4; U2 1 2 6 7 8

## Via types
v1: diameter 0.61, hole 0.305, Top Layer to Bottom Layer, 28 vias

## Routing (per net, layer and track width the routed paths; a pad name or vN(x,y) marks a point on that pad's centre or on a via; arc(x,y) is an arc through that point)
GND: length 50.8
  Top Layer w0.254: v1(131.32,11.68) 131.33,11.68 R12.2 ; R11.1 116.59,19.55 v1(115.82,20.32) ; R8.1 v1(129.29,13.72) ; U2.5 104.01,21.97 v1(103.63,22.35)
  Top Layer w0.508: U4.1 122.62,21.4 v1(122.43,21.59) ; v1(116.33,23.88) 115.77,23.88 Q2.2 ; Q3.2 112.22,21.34 v1(113.03,21.34) ; C11.1 v1(121.92,24.32) ; v1(99.31,14.73) 100.33,13.72 R5.2 ; R7.2 v1(93.73,15.49) ; C12.1 127.51,27.18 v1(127.76,27.43) ; U3.2 101.07,18.8 100.31,18.03 ; C6.1 v1(100.08,16.76) ; C3.1 122.68,48.16 v1(122.68,45.72) ; C9.1 C8.1 v1(134.11,20.83) ; v1(108.97,16.51) 107.38,18.1 C7.1 ; 118.3,27.21 v1(119.89,27.21) ; U1.4 118.72,66.35 D1.2
VIN: length 55.6
  Top Layer w0.254: U2.3 99.38,23.24 99.06,22.92 99.06,21.34 99.95,20.45 104.15,20.45 104.42,20.17 U3.5
  Top Layer w0.508: 106.23,19.56 C7.2 ; 106.23,19.56 104.61,19.56 U3.5 U3.4 ; 106.23,19.56 107.19,19.56 109.47,17.27 v1(110.49,17.27) v1(111.25,17.27) v1(112.01,17.27) v1(112.78,17.27) v1(113.54,17.27) v1(114.3,17.27) ; L3.2 v1(129.1,17.27) v1(128.27,17.27) v1(127.51,17.27) v1(126.75,17.27) v1(125.98,17.27) v1(125.22,17.27) ; L3.2 129.29,19.7 R9.2 ; L3.2 129.38,19.24 C9.2 C8.2
  Bottom Layer w0.508: v1(110.49,17.27) v1(111.25,17.27) v1(112.01,17.27) v1(112.78,17.27) v1(113.54,17.27) v1(114.3,17.27) v1(125.22,17.27) v1(125.98,17.27) v1(126.75,17.27) v1(127.51,17.27) v1(128.27,17.27) v1(129.1,17.27)
EARTH: length 256.4
  Top Layer w5.588: CN2.3 60.45,23.88
  Top Layer w6.35: 60.45,23.88 52.32,15.75 30.48,15.75 19.3,26.92 CN1.2
  Bottom Layer w2.54: C1.1 C5.2 77.64,60.96 58.93,60.96 55.37,64.52 18.8,64.52 16.76,62.48 16.76,44.7 9.14,37.08 9.14,29.46 11.68,26.92 CN1.2
  Bottom Layer w5.588: CN2.3 60.45,23.88
  Bottom Layer w6.35: 60.45,23.88 52.32,15.75 30.48,15.75 19.3,26.92 CN1.2
LIVE_IN: length 72.8
  Top Layer w6.35: K1.5 22.71,33.92 CN1.3
  Bottom Layer w2.54: FH1.2 22.12,59.72 22.12,34.12 21.93,33.92
  Bottom Layer w6.35: CN1.3 22.71,33.92 K1.5
LIVE_OUT: length 103.4
  Top Layer w6.35: K1.4 64.78,38.61 97.82,38.61
  Bottom Layer w6.35: 97.82,38.61 64.78,38.61 K1.4
NEUTRAL: length 218.9
  Top Layer w2.54: CN1.1 11.06,19.92 9.65,21.34 9.65,36.07 23.37,49.78 48.56,49.78 R1.2 59.63,53.05 L1.3 ; C2.2 51.83,53.05
  Top Layer w6.35: 73.61,17.27 64.01,17.27 55.37,8.64 26.92,8.64 15.75,19.81 CN1.1
  Bottom Layer w6.35: 73.66,17.27 64.01,17.27 55.37,8.64 27.04,8.64 CN1.1
NO_SIG: length 30.6
  Top Layer w0.508: 119.33,10.56 119.33,13 116.33,16 116.33,18.54 115.06,19.81 111.5,19.81 R6.2
  Bottom Layer w0.254: 119.33,10.56 124.82,5.08 DS2.2
TEMP: length 24.6
  Top Layer w0.508: 116.56,10.56 116.56,14.69 115.57,15.69 115.57,18.03 114.55,19.05 108.77,19.05 106.74,21.08 102.87,21.08 101.98,21.97 U2.4
VRAW: length 152.2
  Top Layer w0.254: U1.6 104.82,44.45 43.92,44.45 K1.1
  Top Layer w0.508: 126.49,22.86 127.45,22.86 C12.2 ; 126.49,22.86 125.54,22.86 C11.2 125.1,23.3 U4.3 122.87,23.3 121.92,22.35 U4.5 ; 126.49,22.86 126.49,25.41 ; 126.49,25.41 126.49,29.49 D2.1 126.01,48.51 C4.1 126.3,51.47 C3.2 123.57,52.49 D1.1 122.28,56.04 U1.6 ; 126.49,25.41 126.48,25.39 118.11,25.39 ; R2.2 117.09,22.86 118.11,23.88 118.11,25.39 ; 118.11,25.39 R3.2
VSW: length 34.6
  Top Layer w0.508: D3.2 106.02,16.89 103.63,16.89 103.12,17.4 103.12,19.3 102.74,19.69 101.88,19.69 U3.1 100.33,19.75 C6.2 100.01,19.56 98.81,19.56 98.04,18.8 98.04,4.57 97.03,3.56 94.74,3.56 DS1.2
$1N1636: length 91
  Top Layer w0.254: K1.2 53.36,43.69 117.86,43.69 120.9,40.64 120.9,30 D2.2
  Top Layer w0.508: 117.35,29.68 120.59,29.68 D2.2
$1N1642: length 5
  Top Layer w0.508: R2.1 112.84,23.06 Q2.1 110.78,24.91 Q3.3
$1N1954: length 11.1
  Top Layer w2.54: L1.4 56.87,69.6 L2.2
$1N1959: length 19.2
  Top Layer w2.54: U1.2 79.37,71.04 C5.1 74.62,71.04 L1.2
$1N1966: length 20.2
  Bottom Layer w2.54: U1.1 84.58,54.69 C1.2 72.11,53.44 L1.1
$1N3143: length 11
  Top Layer w0.254: 117.95,7.72 121.01,7.72 122.43,9.14 122.43,12.19 123.95,13.72 R8.2
$1N3234: length 4.6
  Top Layer w0.508: R3.1 116.4,25.6 116.4,27.21 114.1,27.21 Q2.3
$1N7143: length 2.3
  Top Layer w0.508: R4.1 101.82,16.29 U3.3
$1N7225: length 2
  Top Layer w0.508: R4.2 R5.1
$1N7266: length 8.6
  Top Layer w0.254: DS2.1 134.87,13.71 R12.1
$1N7306: length 8.8
  Top Layer w0.508: DS1.1 95.76,13.2 R7.1
$1N7956: length 5.8
  Top Layer w0.508: C10.2 124.84,19.3 L3.1 124.97,19.6 124.97,21.67 124.28,22.35 U4.2
$1N8144: length 2.3
  Top Layer w0.508: C10.1 121.73,20.9 U4.6
$1N8366: length 30.9
  Top Layer w0.254: R9.1 134.88,24.38 135.89,23.37 135.89,17.27 134.87,16.26 121.04,16.26 R10.2
$1N8390: length 7.8
  Top Layer w0.254: U4.4 120.08,23.3 119.25,22.48 R10.1 118.5,18.8 118.1,18.8 R11.2
$1N8924: length 6
  Top Layer w0.508: 111.02,10.56 111.02,13.49 111.76,14.22 D3.1
$1N10465: length 2.1
  Top Layer w0.508: Q3.1 109.48,22.17 R6.1
$1N17471: length 22.8
  Top Layer w2.54: R1.1 44.33,60.67 ; FH1.1 44.04,60.96 C2.1 45.25,61.6 L2.1
$1N23165: length 88.5
  Top Layer w6.35: 73.41,30.48 106.17,30.48 FH2.2
  Bottom Layer w6.35: 73.41,30.48 106.17,30.48 FH2.2

## Copper pours and planes (outline as drawn; the poured copper is in the pictures)
GND on Top Layer: 113.03,85.85 113.03,48.51 120.9,40.64 120.9,36.07 111.38,26.55 92.08,26.55 90.68,25.15 90.68,-5.59 90.93,-5.84 150.37,-5.84 150.88,-6.35 150.88,84.07 149.1,85.85
GND on Bottom Layer: 113.03,85.85 113.03,48.51 120.9,40.64 120.9,36.07 111.38,26.55 92.08,26.55 90.68,25.15 90.68,-5.59 90.93,-5.84 150.37,-5.84 150.88,-6.35 150.88,84.07 149.1,85.85
STEAL on Top Layer: 110.74,83.31 110.74,42.16 88.65,20.07 88.65,-4.57 -19.3,-4.57 -20.32,-5.59 -20.32,93.47 -19.81,93.98 100.08,93.98
STEAL on Bottom Layer: -5.84,85.6 -5.84,-11.94 -7.62,-13.72 96.52,-13.72 99.57,-16.76 120.65,4.32 120.65,95.76 4.32,95.76

## Text on the board
Top Silkscreen Layer: Designed By: Jim Heaney, RIT SHED Makerspace | Access Control AC Power Relay | Version 2.1.1 | Oct 2024 | PWR | ON
